# EAGLE design foot-board (EAGLE 9.6.2)
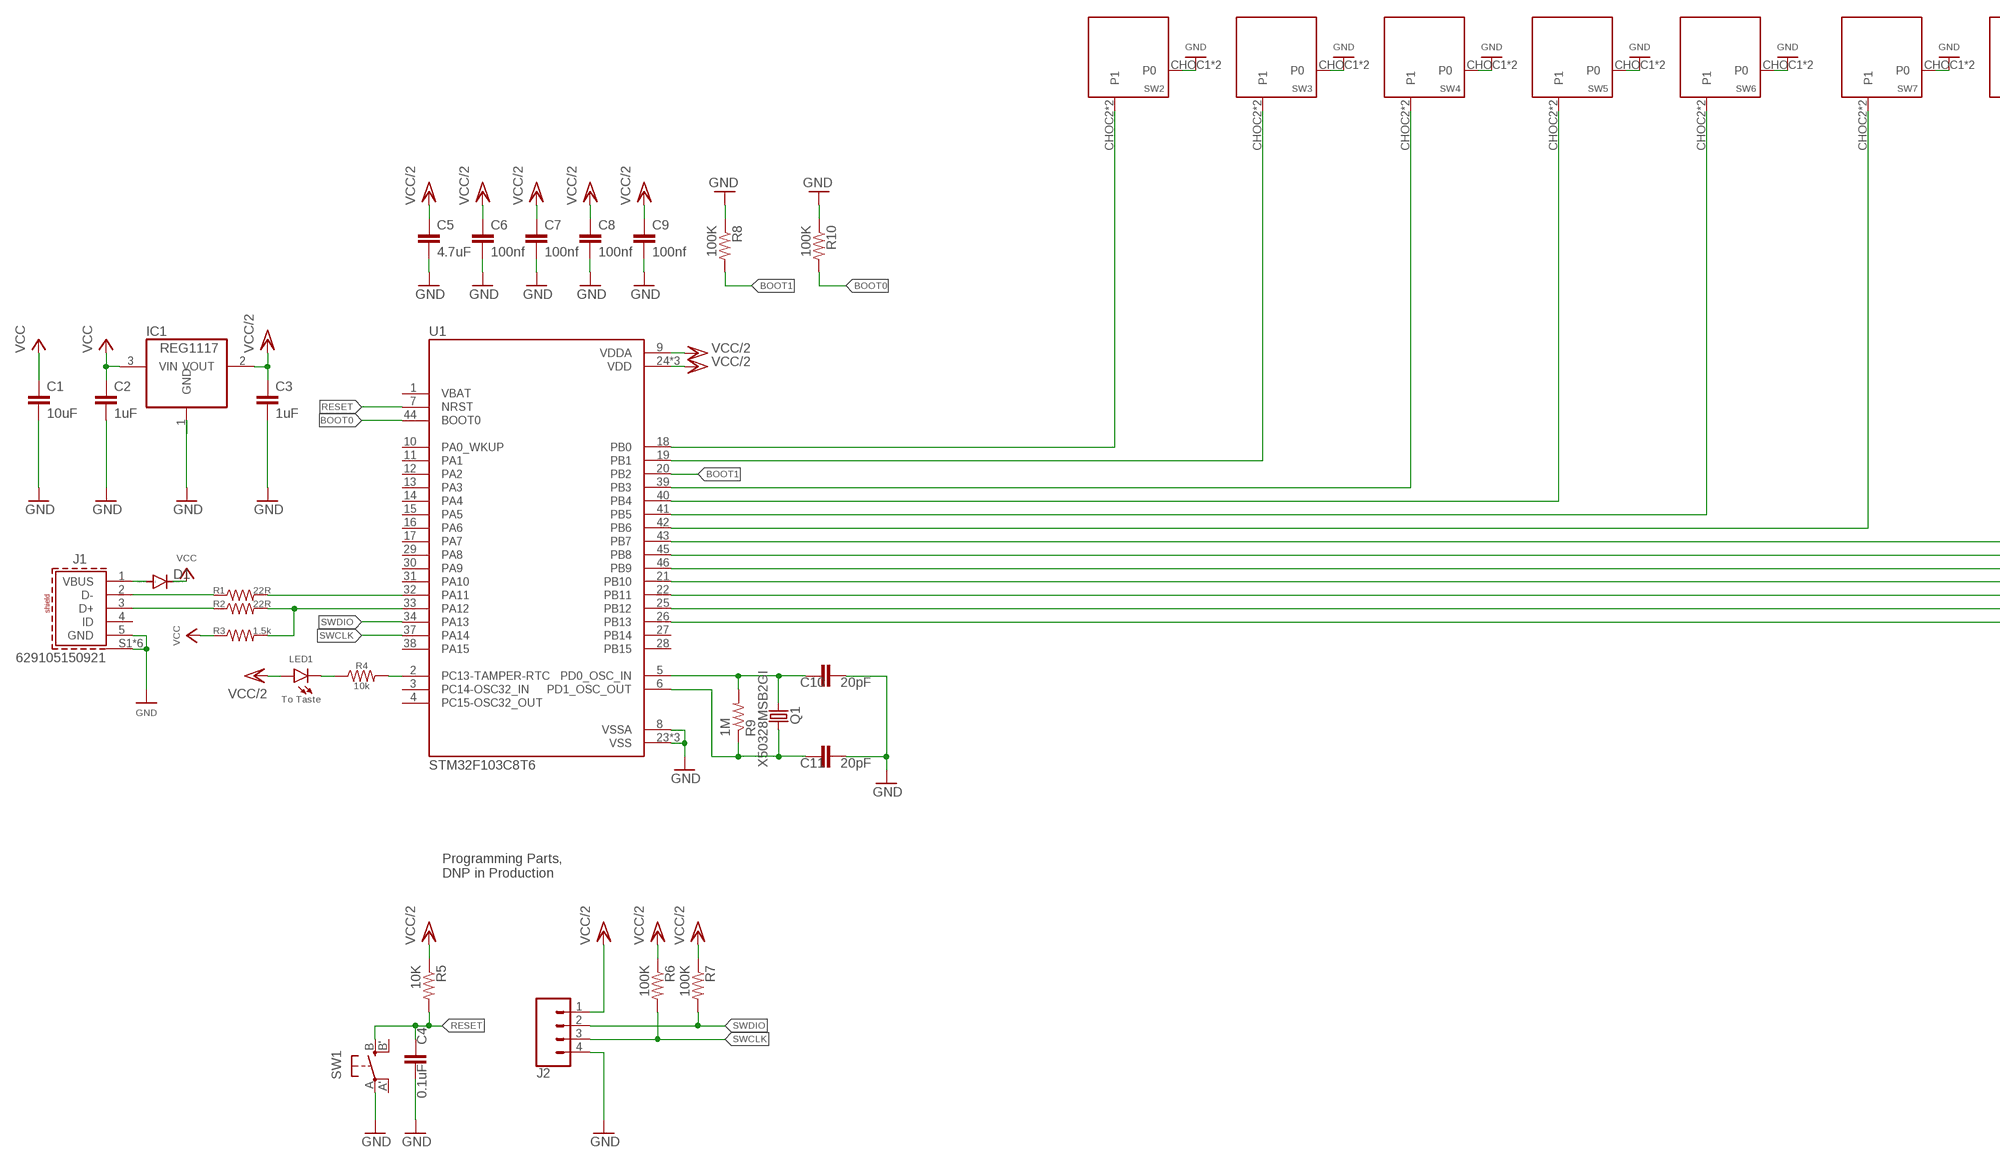
[diagram p0: schematic, sheet 1, part 1 of 2]
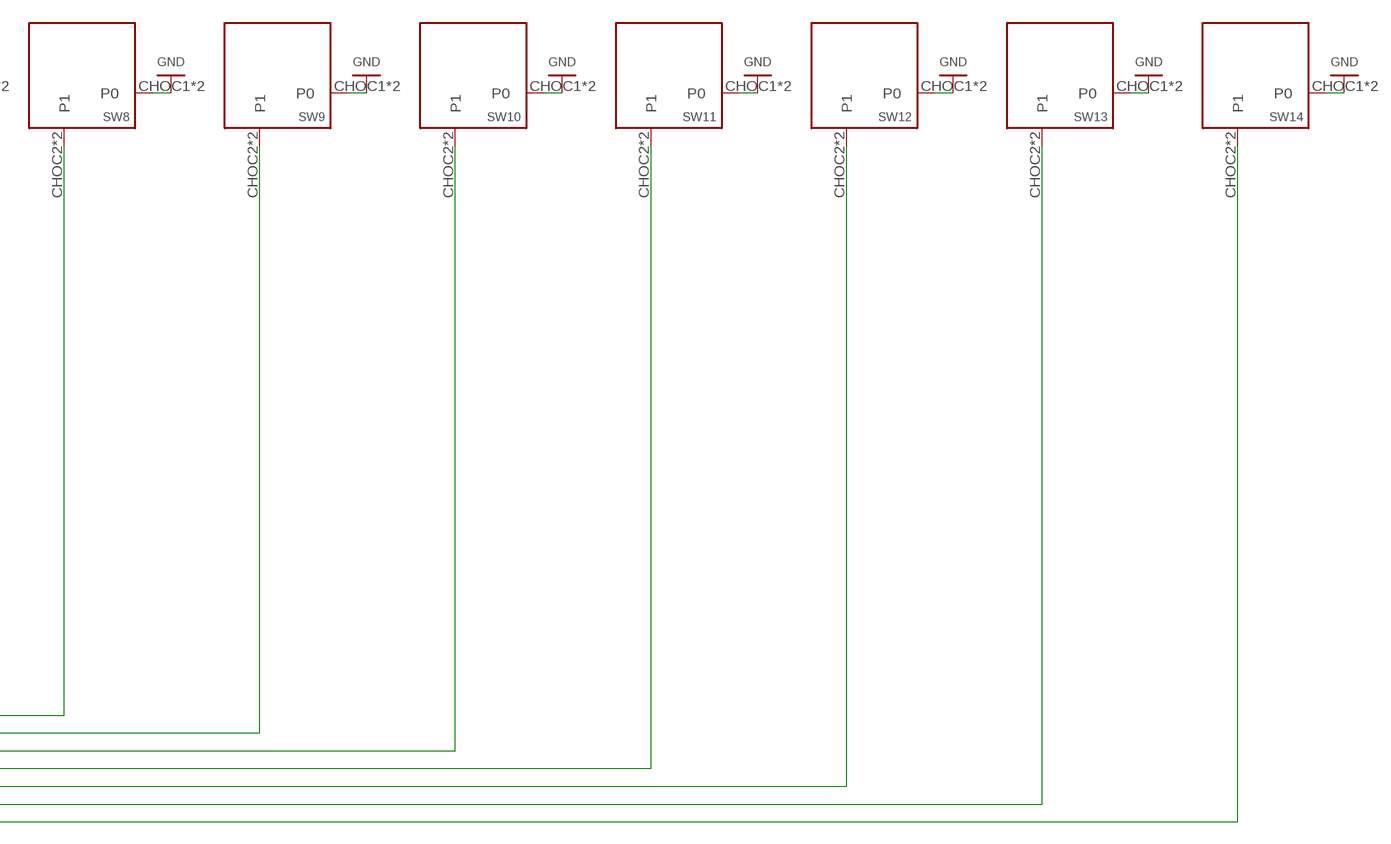
[diagram p1: schematic, sheet 1, part 2 of 2]

## Parts
C1  10uF  C-EUC0805  [C0805]
C2  1uF  C-EUC0402  [C0402]
C3  1uF  C-EUC0402  [C0402]
C4  0.1uF  C-EUC0402  [C0402]
C5  4.7uF  C-EUC0805  [C0805]
C6  100nf  C-EUC0402  [C0402]
C7  100nf  C-EUC0402  [C0402]
C8  100nf  C-EUC0402  [C0402]
C9  100nf  C-EUC0402  [C0402]
C10  20pF  C-EUC0402  [C0402]
C11  20pF  C-EUC0402  [C0402]
D1  DIODE-DO214AC  [DO214AC]
IC1  REG1117  [SOT223]
J1  629105150921  [629105150921]
J2  CONN_04  [1X04]
LED1  To Taste  LEDCHIPLED_0603  [CHIPLED_0603]
Q1  X50328MSB2GI  KX-12B  [6.0X3.5_2]
R1  22R  R-US_R0402  [R0402]
R2  22R  R-US_R0402  [R0402]
R3  1.5k  R-US_R0402  [R0402]
R4  10k  R-US_R0402  [R0402]
R5  10K  R-US_R0402  [R0402]
R6  100K  R-US_R0402  [R0402]
R7  100K  R-US_R0402  [R0402]
R8  100K  R-US_R0402  [R0402]
R9  1M  R-US_R0402  [R0402]
R10  100K  R-US_R0402  [R0402]
SW1  SPST_TACT-EVQQ2  [EVQ-Q2]
SW2  KEYSWITCH-PLAIN-CHOCX-1U  [CHOCX-1U]
SW3  KEYSWITCH-PLAIN-CHOCX-1U  [CHOCX-1U]
SW4  KEYSWITCH-PLAIN-CHOCX-1U  [CHOCX-1U]
SW5  KEYSWITCH-PLAIN-CHOCX-1U  [CHOCX-1U]
SW6  KEYSWITCH-PLAIN-CHOCX-1U  [CHOCX-1U]
SW7  KEYSWITCH-PLAIN-CHOCX-1U  [CHOCX-1U]
SW8  KEYSWITCH-PLAIN-CHOCX-1U  [CHOCX-1U]
SW9  KEYSWITCH-PLAIN-CHOCX-1U  [CHOCX-1U]
SW10  KEYSWITCH-PLAIN-CHOCX-1U  [CHOCX-1U]
SW11  KEYSWITCH-PLAIN-CHOCX-1U  [CHOCX-1U]
SW12  KEYSWITCH-PLAIN-CHOCX-1U  [CHOCX-1U]
SW13  KEYSWITCH-PLAIN-CHOCX-1U  [CHOCX-1U]
SW14  KEYSWITCH-PLAIN-CHOCX-1U  [CHOCX-1U]
U1  STM32F103C8T6  [QFP50P900X900X160-48N]

## Nets
BOOT0: R10.2 U1.44(BOOT0)
BOOT1: R8.2 U1.20(PB2)
GND: C1.2 C2.2 C3.2 C4.2 C5.2 C6.2 C7.2 C8.2 C9.2 C10.2 C11.2 IC1.1(GND) J1.5(GND) J1.S1(SHIELD) J1.S2(SHIELD) J1.S3(SHIELD) J1.S4(SHIELD) J1.S5(SHIELD) J1.S6(SHIELD) J2.4 R8.1 R10.1 SW1.A(P) SW2.CHOC1(P0) SW2.X1(P0) SW3.CHOC1(P0) SW3.X1(P0) SW4.CHOC1(P0) SW4.X1(P0) SW5.CHOC1(P0) SW5.X1(P0) SW6.CHOC1(P0) SW6.X1(P0) SW7.CHOC1(P0) SW7.X1(P0) SW8.CHOC1(P0) SW8.X1(P0) SW9.CHOC1(P0) SW9.X1(P0) SW10.CHOC1(P0) SW10.X1(P0) SW11.CHOC1(P0) SW11.X1(P0) SW12.CHOC1(P0) SW12.X1(P0) SW13.CHOC1(P0) SW13.X1(P0) SW14.CHOC1(P0) SW14.X1(P0) U1.8(VSSA) U1.23(VSS) U1.35(VSS) U1.47(VSS)
N$1: R4.2 U1.2(PC13-TAMPER-RTC)
N$2: LED1.C R4.1
N$3: SW2.CHOC2(P1) SW2.X2(P1) U1.18(PB0)
N$4: R1.2 U1.32(PA11)
N$5: D1.A J1.1(VBUS)
N$6: R2.2 R3.2 U1.33(PA12)
N$10: SW3.CHOC2(P1) SW3.X2(P1) U1.19(PB1)
N$11: SW4.CHOC2(P1) SW4.X2(P1) U1.39(PB3)
N$12: SW5.CHOC2(P1) SW5.X2(P1) U1.40(PB4)
N$13: SW6.CHOC2(P1) SW6.X2(P1) U1.41(PB5)
N$14: SW7.CHOC2(P1) SW7.X2(P1) U1.42(PB6)
N$15: SW8.CHOC2(P1) SW8.X2(P1) U1.43(PB7)
N$16: SW9.CHOC2(P1) SW9.X2(P1) U1.45(PB8)
N$17: SW10.CHOC2(P1) SW10.X2(P1) U1.46(PB9)
N$18: SW11.CHOC2(P1) SW11.X2(P1) U1.21(PB10)
N$19: J1.2(D-) R1.1
N$20: J1.3(D+) R2.1
N$21: SW12.CHOC2(P1) SW12.X2(P1) U1.22(PB11)
N$22: SW13.CHOC2(P1) SW13.X2(P1) U1.25(PB12)
N$23: SW14.CHOC2(P1) SW14.X2(P1) U1.26(PB13)
N$213: C10.1 Q1.2 R9.2 U1.5(PD0_OSC_IN)
N$214: C11.1 Q1.1 R9.1 U1.6(PD1_OSC_OUT)
RESET: C4.1 R5.2 SW1.B(S) U1.7(NRST)
SWCLK: J2.3 R6.2 U1.37(PA14)
SWDIO: J2.2 R7.2 U1.34(PA13)
VCC: C1.1 C2.1 D1.C IC1.3(VIN) R3.1
VCC/2: C3.1 C5.1 C6.1 C7.1 C8.1 C9.1 IC1.2(VOUT) J2.1 LED1.A R5.1 R6.1 R7.1 U1.9(VDDA) U1.24(VDD) U1.36(VDD) U1.48(VDD)
Unconnected: J1.4(ID) SW1.A'(P1) SW1.B'(S1) U1.1(VBAT) U1.3(PC14-OSC32_IN) U1.4(PC15-OSC32_OUT) U1.10(PA0_WKUP) U1.11(PA1) U1.12(PA2) U1.13(PA3) U1.14(PA4) U1.15(PA5) U1.16(PA6) U1.17(PA7) U1.27(PB14) U1.28(PB15) U1.29(PA8) U1.30(PA9) U1.31(PA10) U1.38(PA15)

## Notes on the sheet
- Programming Parts, 
  DNP in Production

## Library data of the parts
C1-C11 = rcl:C-EU: CAPACITOR, European symbol; SPICEPREFIX: C
D1 = diode:DIODE-: DIODE
IC1 = burr-brown:REG1117: 800mA and 1A Low Dropout (LDO) Positive Regulator 1.8V, 2.5V, 2.85V, 3.3V, 5V, and Adj; MPN: REG1117; OC_FARNELL: 1097566; OC_NEWARK: 14P6981
J1 = Wurth_Connectors_WR-USB:629105150921: WR-COM Micro USB 2.0 Type AB Horizontal Kind Properties Durability:10 000 Mating cycles Connector Type:Micro USB Gender:Receptacle Type:Horizontal General Information Operating Temperature:-40up to +85 °C Electrical Properties Working Voltage:30V (AC) Withstanding Voltage:100V (AC) Contact Resistance:30 mΩ Material Properties Insulator Material:LCP Insulator Flammability Rating:UL94 V-0 Color:Black Contact Material:Copper Alloy Contact Plating: Gold Contact Type:Stamped Shielding Material:Stainless Steel Shielding Plating:Matte Tin <https://www.we-online.com/catalog/media/o33046v209%20Family_WR-COM_Micro_USB_629105150921.jpg> Details see: https://www.we-online.com/catalog/en/COM_MICRO_2_0_TYPE_AB_HORIZONTAL/ Updated by Ella Wu 2020-05-27 2020 (C) Würth Elektronik; APPLICATION: Micro USB 2.0; DATASHEET-URL: https://www.we-online.com/catalog/datasheet/629105150921.pdf; GERDER: Receptacle; INTERFACE-TYPE: Type AB; IR1: 1.8A; MOUNT: SMT; PACKAGING: Tape and Reel; PART-NUMBER: 629105150921; PINS: 5; TYPE: Horizontal; WORKING-VOLTAGE: 30V(AC)
J2 = SparkFun-Connectors:CONN_04: Multi connection point. Often used as Generic Header-pin footprint for 0.1 inch spaced/style header connections On any of the 0.1 inch spaced packages, you can populate with these: Break Away Headers - Straight <https://www.sparkfun.com/products/116> (PRT-00116) Break Away Male Headers - Right Angle <https://www.sparkfun.com/products/553> (PRT-00553) Female Headers <https://www.sparkfun.com/products/115> (PRT-00115) Break Away Headers - Machine Pin <https://www.sparkfun.com/products/117> (PRT-00117) Break Away Female Headers - Swiss Machine Pin <https://www.sparkfun.com/products/743> (PRT-00743) For SCREWTERMINALS and SPRING TERMINALS visit here: Screw Terimnals on SparkFun.com <https://www.sparkfun.com/search/results?term=Screw+Terminals> (5mm/3.5mm/2.54mm spacing) This device is also useful as a general connection point to wire up your design to another part of your project. Our various solder wires solder well into these plated through hole pads. Hook-Up Wire - Assortment (Stranded, 22 AWG) <https://www.sparkfun.com/products/11375> (PRT-11375) Hook-Up Wire - Assortment (Solid Core, 22 AWG) <https://www.sparkfun.com/products/11367> (PRT-11367) View the entire wire category on our website here <https://www.sparkfun.com/categories/141> Special notes: Molex polarized connector foot print use with SKU : PRT-08231 with associated crimp pins and housings. 1MM SMD Version SKU: PRT-10208; PROD_ID: CONN-09696
LED1 = led:LED: LED OSRAM: - CHIPLED LG R971, LG N971, LY N971, LG Q971, LY Q971, LO R971, LY R971 LH N974, LH R974 LS Q976, LO Q976, LY Q976 LO Q996 - Hyper CHIPLED LW Q18S LB Q993, LB Q99A, LB R99A - SideLED LS A670, LO A670, LY A670, LG A670, LP A670 LB A673, LV A673, LT A673, LW A673 LH A674 LY A675 LS A676, LA A676, LO A676, LY A676, LW A676 LS A679, LY A679, LG A679 - Hyper Micro SIDELED® LS Y876, LA Y876, LO Y876, LY Y876 LT Y87S - SmartLED LW L88C, LW L88S LB L89C, LB L89S, LG L890 LS L89K, LO L89K, LY L89K LS L896, LA L896, LO L896, LY L896 - TOPLED LS T670, LO T670, LY T670, LG T670, LP T670 LSG T670, LSP T670, LSY T670, LOP T670, LYG T670 LG T671, LOG T671, LSG T671 LB T673, LV T673, LT T673, LW T673 LH T674 LS T676, LA T676, LO T676, LY T676, LB T676, LH T676, LSB T676, LW T676 LB T67C, LV T67C, LT T67C, LS T67K, LO T67K, LY T67K, LW E67C LS E67B, LA E67B, LO E67B, LY E67B, LB E67C, LV E67C, LT E67C LW T67C LS T679, LY T679, LG T679 LS T770, LO T770, LY T770, LG T770, LP T770 LB T773, LV T773, LT T773, LW T773 LH T774 LS E675, LA E675, LY E675, LS T675 LS T776, LA T776, LO T776, LY T776, LB T776 LHGB T686 LT T68C, LB T68C - Hyper Mini TOPLED® LB M676 - Mini TOPLED Santana® LG M470 LS M47K, LO M47K, LY M47K Source: http://www.osram.convergy.de LUXEON: - LUMILED® LXK2-PW12-R00, LXK2-PW12-S00, LXK2-PW14-U00, LXK2-PW14-V00 LXK2-PM12-R00, LXK2-PM12-S00, LXK2-PM14-U00 LXK2-PE12-Q00, LXK2-PE12-R00, LXK2-PE12-S00, LXK2-PE14-T00, LXK2-PE14-U00 LXK2-PB12-K00, LXK2-PB12-L00, LXK2-PB12-M00, LXK2-PB14-N00, LXK2-PB14-P00, LXK2-PB14-Q00 LXK2-PR12-L00, LXK2-PR12-M00, LXK2-PR14-Q00, LXK2-PR14-R00 LXK2-PD12-Q00, LXK2-PD12-R00, LXK2-PD12-S00 LXK2-PH12-R00, LXK2-PH12-S00 LXK2-PL12-P00, LXK2-PL12-Q00, LXK2-PL12-R00 Source: www.luxeon.com KINGBRIGHT: KA-3528ASYC Source: www.kingbright.com
Q1 = crystal-geyer_V1_0:KX: Quartz Crystals (MHz) SMD: KX - Serie Model Size l/w/h [mm] Frequency Range Frequency Stability Temp. Range [°C] Load Capacitance AECQ 200 availabel Datasheet KX-4 KX-5 KX-6 KX-7 KX-9A KX-9B KX-12A KX-12B KX-13 KX-20 KX-K KX-KS 1.6/1.2/0.3 2.0/1.6/0.45 2.5/2.0/0.55 3.2/2.5/0.8 5.0/3.2/1.0 5.0/3.2/1.1 6.0/3.5/1.1 6.0/3.5/1.0 7.0/5.0 /1.3 11.6/5.5/1.6 12.3/4.5/4.2 12.3/4.5/3.2 24.0 ~ 80.0 MHz 16.0 ~ 80.0 MHz 12.0 ~ 80.0 MHz 8.0 ~ 60.0 MHz 7,68 ~ 300,0 MHz 8,0 ~ 50,0 MHz 8,0 ~ 150,0 MHz 8,0 ~ 50,0 MHz 6,0 ~ 160,0 MHz 3,579 ~ 25,0 MHz 3,579 ~ 70,0 MHz 3,579 ~ 70,0 MHz ±10 … ±50ppm ±10 … ±50ppm ±10 … ±50ppm ±10 … ±50ppm ±10 … ±50ppm ±10 … ±50ppm ±10 … ±50ppm ±10 … ±50ppm ±10 … ±50ppm ±50ppm ±10 … ±50ppm ±10 … ±50ppm (*) -40°C …+85°C (*) -40°C …+125°C (*) -40°C …+125°C (*) -40°C …+125°C (*) -40°C …+105°C (*) -40°C …+105°C (*) -40°C …+125°C (*) -40°C …+105°C (*) -40°C …+105°C (*) -40°C …+105°C (*) -40°C …+85°C (*) -40°C …+85°C 8, 8…16 8, 8…16 10, 8…16 12, 7…20 16, 10…20 16, 10…20 16, 10…20 16, 12…20 16, 12…20 16, 12…20 16, 12…30 16, 12…30 - yes yes yes - - - - - - - - KX-4.pdf <http://www.geyer-electronic.de/uploads/tx_userartikelfrequenz/GEYER-KX-4.pdf> KX-5.pdf <http://www.geyer-electronic.de/uploads/tx_userartikelfrequenz/GEYER-KX-5.pdf> KX-6.pdf <http://www.geyer-electronic.de/uploads/tx_userartikelfrequenz/GEYER-KX-6.pdf> KX-7.pdf <http://www.geyer-electronic.de/uploads/tx_userartikelfrequenz/GEYER-KX-7.pdf> KX-9A.pdf <http://www.geyer-electronic.de/uploads/tx_userartikelfrequenz/GEYER-KX-9A.pdf> KX-9B.pdf <http://www.geyer-electronic.de/uploads/tx_userartikelfrequenz/GEYER-KX-9B.pdf> KX-12A.pdf <http://www.geyer-electronic.de/uploads/tx_userartikelfrequenz/GEYER-KX-12A.pdf> KX-12B.pdf <http://www.geyer-electronic.de/uploads/tx_userartikelfrequenz/GEYER-KX-12B.pdf> KX-13.pdf <http://www.geyer-electronic.de/uploads/tx_userartikelfrequenz/GEYER-KX-13.pdf> KX-20.pdf <http://www.geyer-electronic.de/uploads/tx_userartikelfrequenz/GEYER-KX-20.pdf> KX-K.pdf <http://www.geyer-electronic.de/uploads/tx_userartikelfrequenz/GEYER-KX-K.pdf> KX-KS.pdf <http://www.geyer-electronic.de/uploads/tx_userartikelfrequenz/GEYER-KX-KS.pdf> <http://www.geyer-electronic.de/fileadmin/template/img/logo-geyer-electronic.png> Details see: http://www.geyer-electronic.de/Frequenz-Produkte.9.0.html Created 2016-06-07, Hans Locher 2016 (C) Geyer Quartz Technology KX4,KX5,KX6,KX7,KX9A,KX9B,KX12A,KX12B,KX13,KX20,KXK,KXKS;1612;2016;2520;3225;5032;6035;7050;11655;12345;1,6x1,2;2,0x1,6;2,5x2,0;3,2x2,5;5,0x3,2;6,0x3,5;7,0x5,0;11,6x5,5;12,3x4,5;12,3x4,5;1.6x1.2;2.0x1.6;2.5x2.0;3.2x2.5;5.0x3.2;6.0x3.5;7.0x5.0;11.6x5.5;12.3x4.5;12.3x4.5;
R1-R10 = rcl:R-US_: RESISTOR, American symbol; SPICEPREFIX: R
SW1 = adafruit:SPST_TACT: SMT 6mm switch, EVQQ2 series http://www.ladyada.net/library/eagle
SW2-SW14 = Keyswitch:KEYSWITCH-PLAIN
U1 = STM32F103C8T6:STM32F103C8T6: Mainstream Performance line, ARM Cortex-M3 MCU with 64 Kbytes Flash, 72 MHz CPU, motor control, USB and CAN; AVAILABILITY: Unavailable; DESCRIPTION: ARM® Cortex®-M3 STM32F1 Microcontroller IC 32-Bit 72MHz 64KB (64K x 8) FLASH 48-LQFP (7x7); MF: STMicroelectronics; MP: STM32F103C8T6; PACKAGE: LQFP-48 STMicroelectronics; PRICE: None

## Board
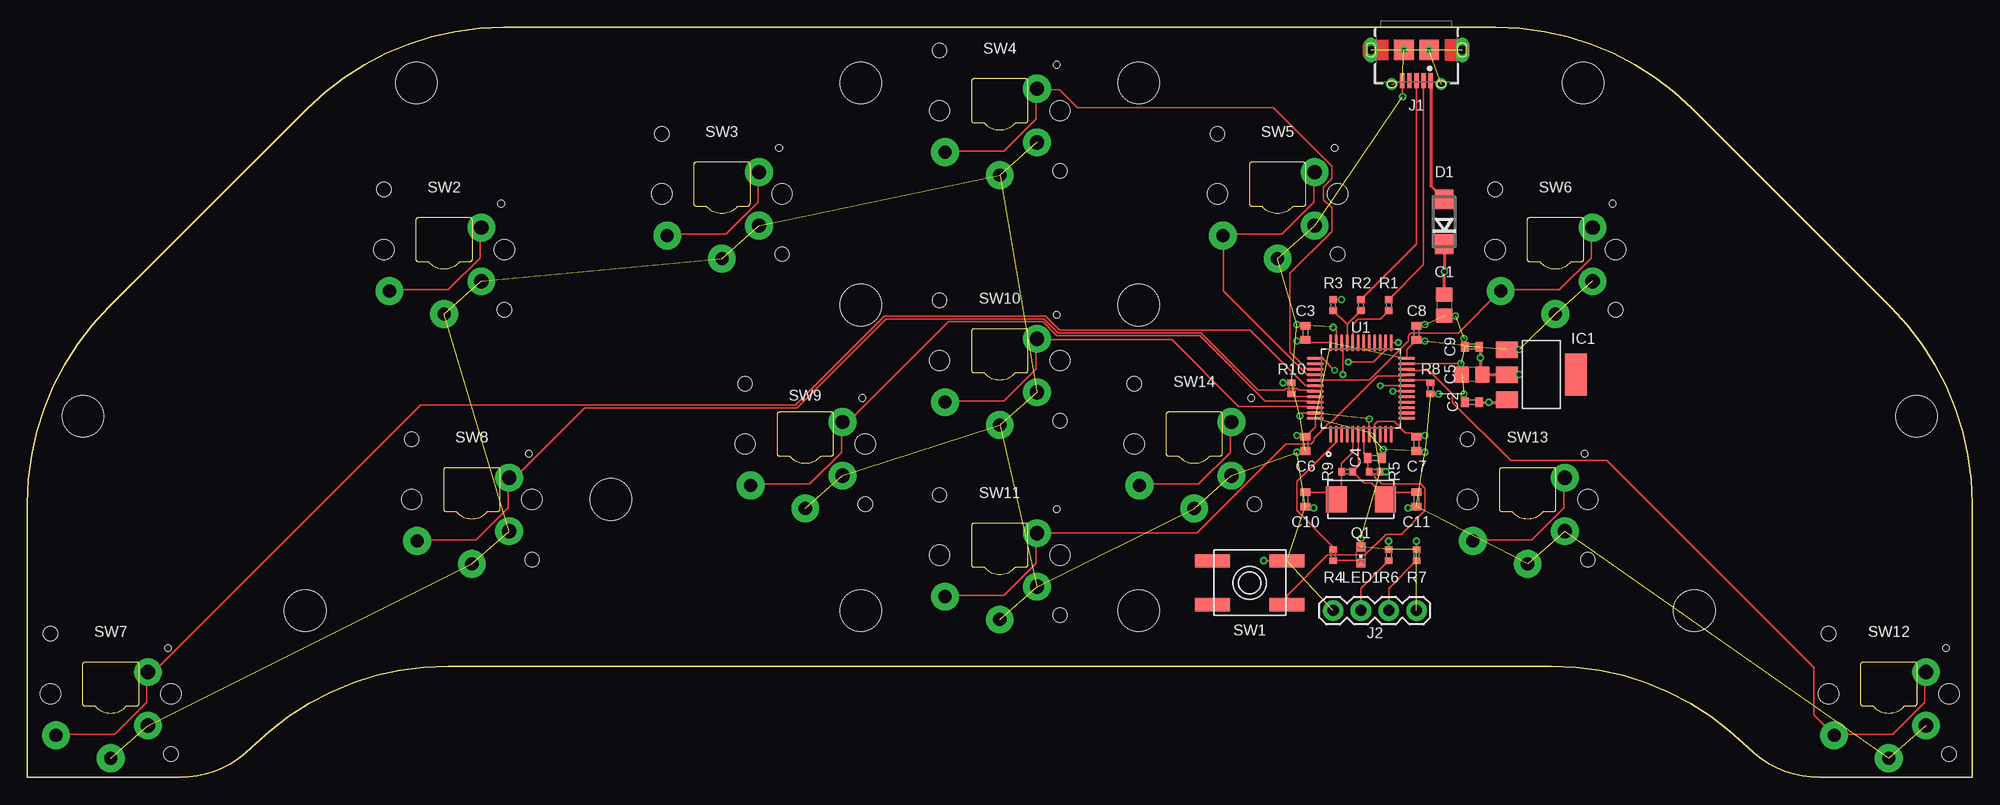
[diagram p2: board, top side]
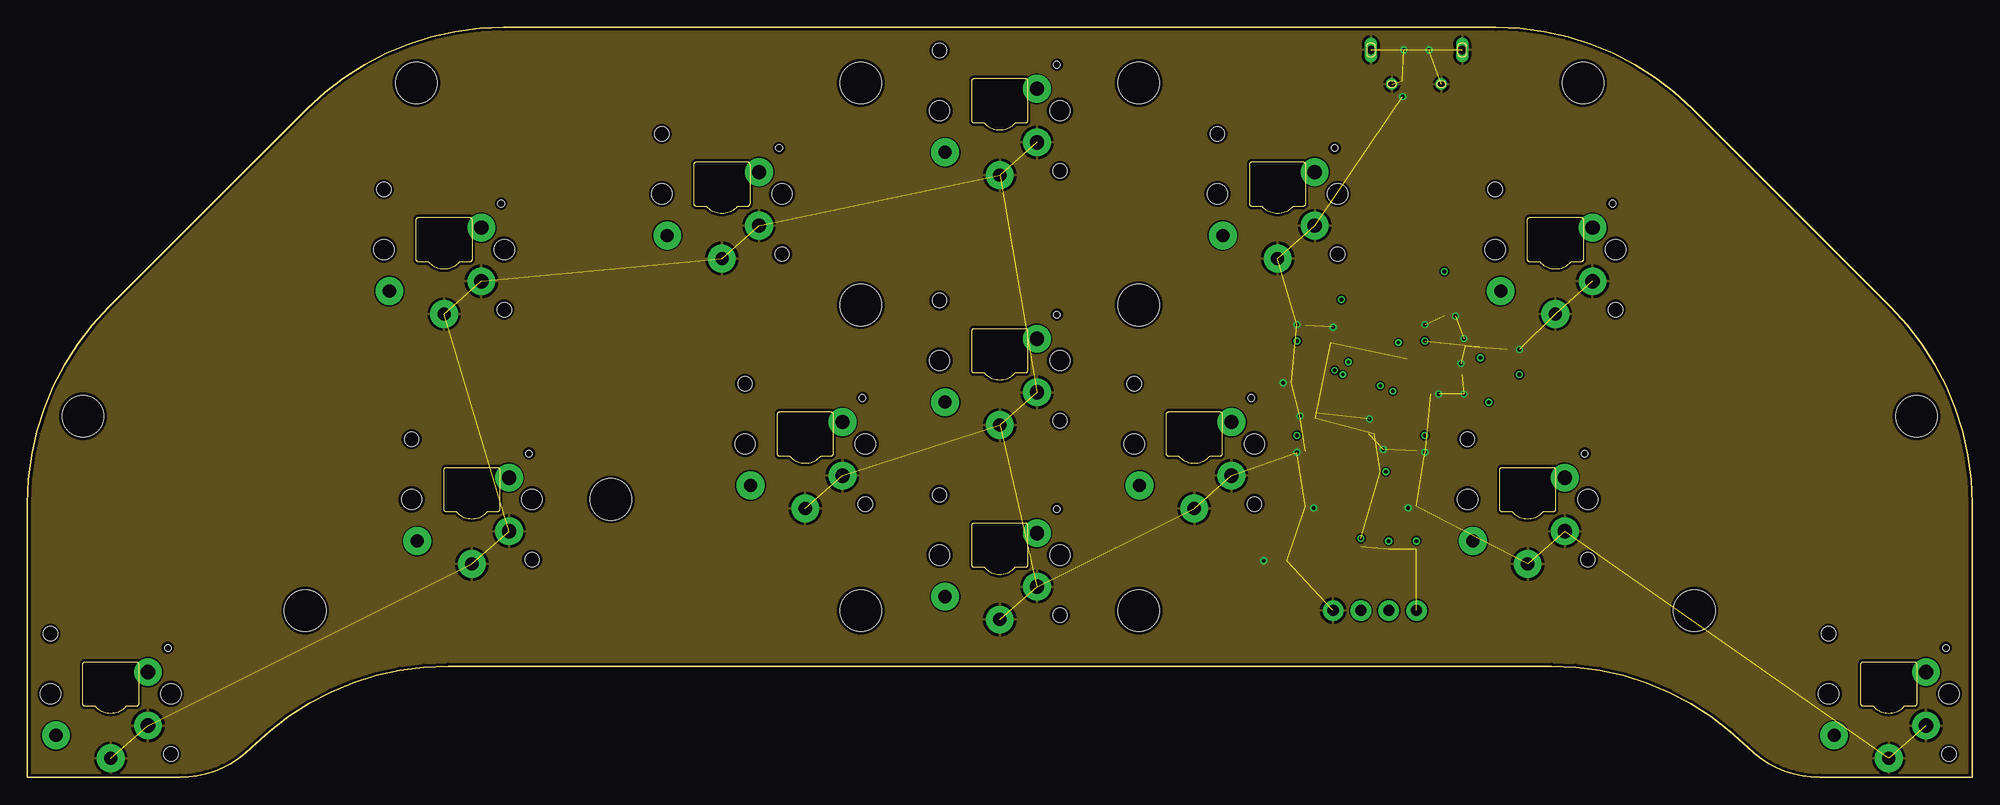
[diagram p3: board, inner layer Route2]
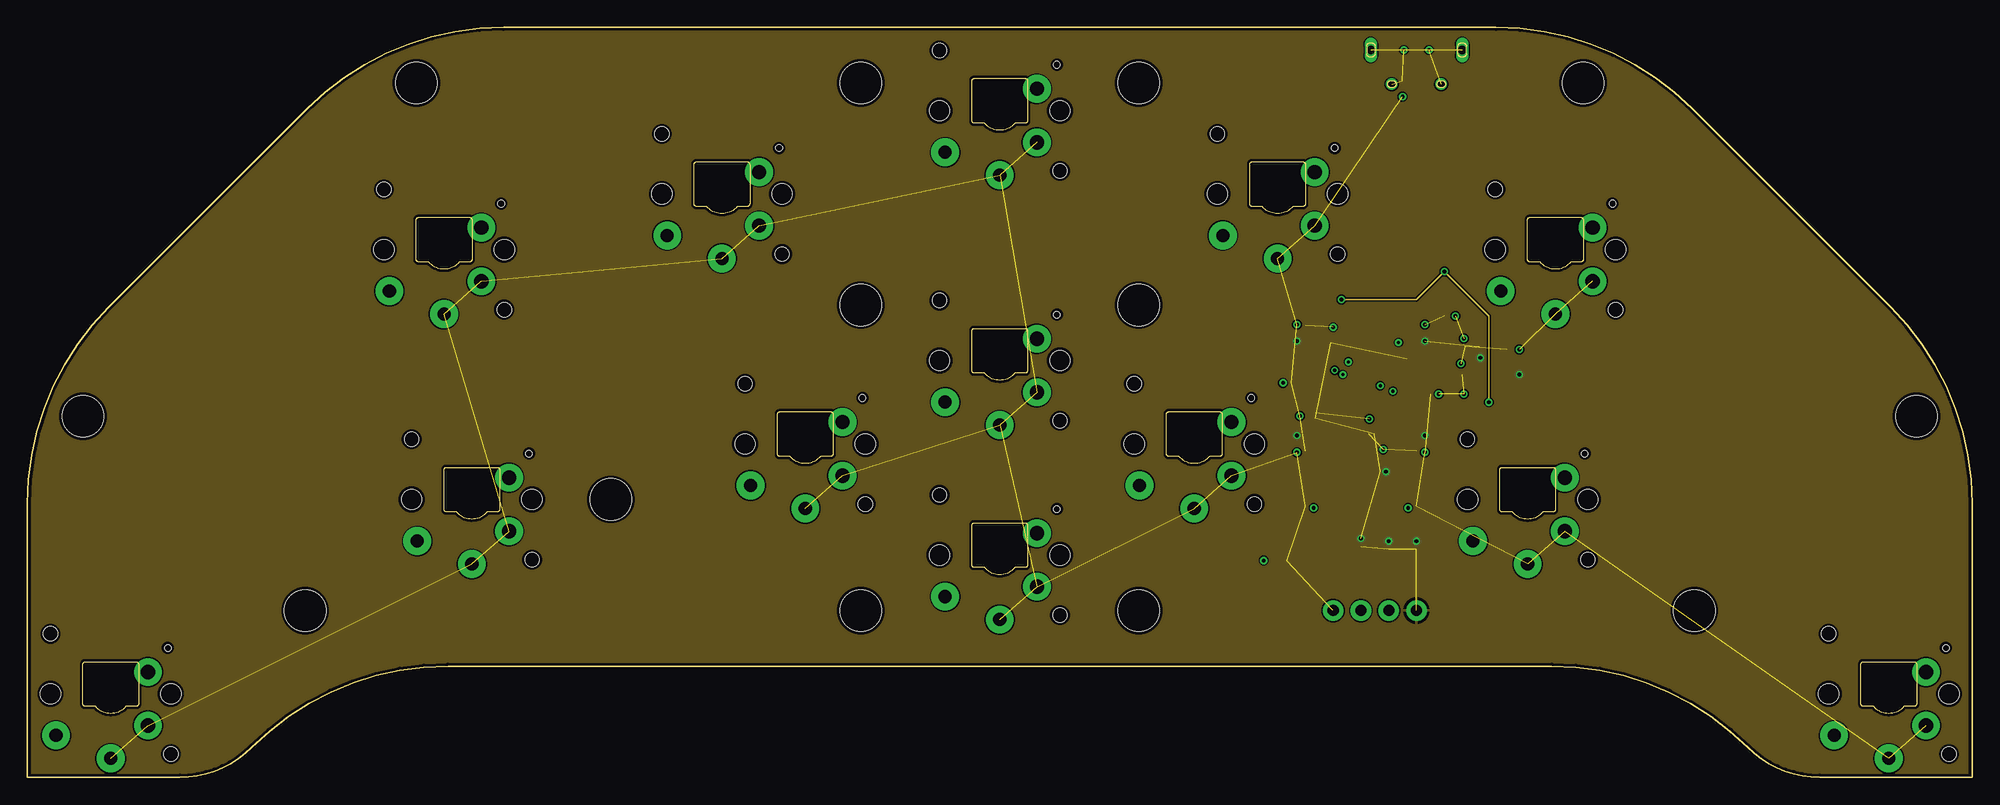
[diagram p4: board, inner layer Route15]
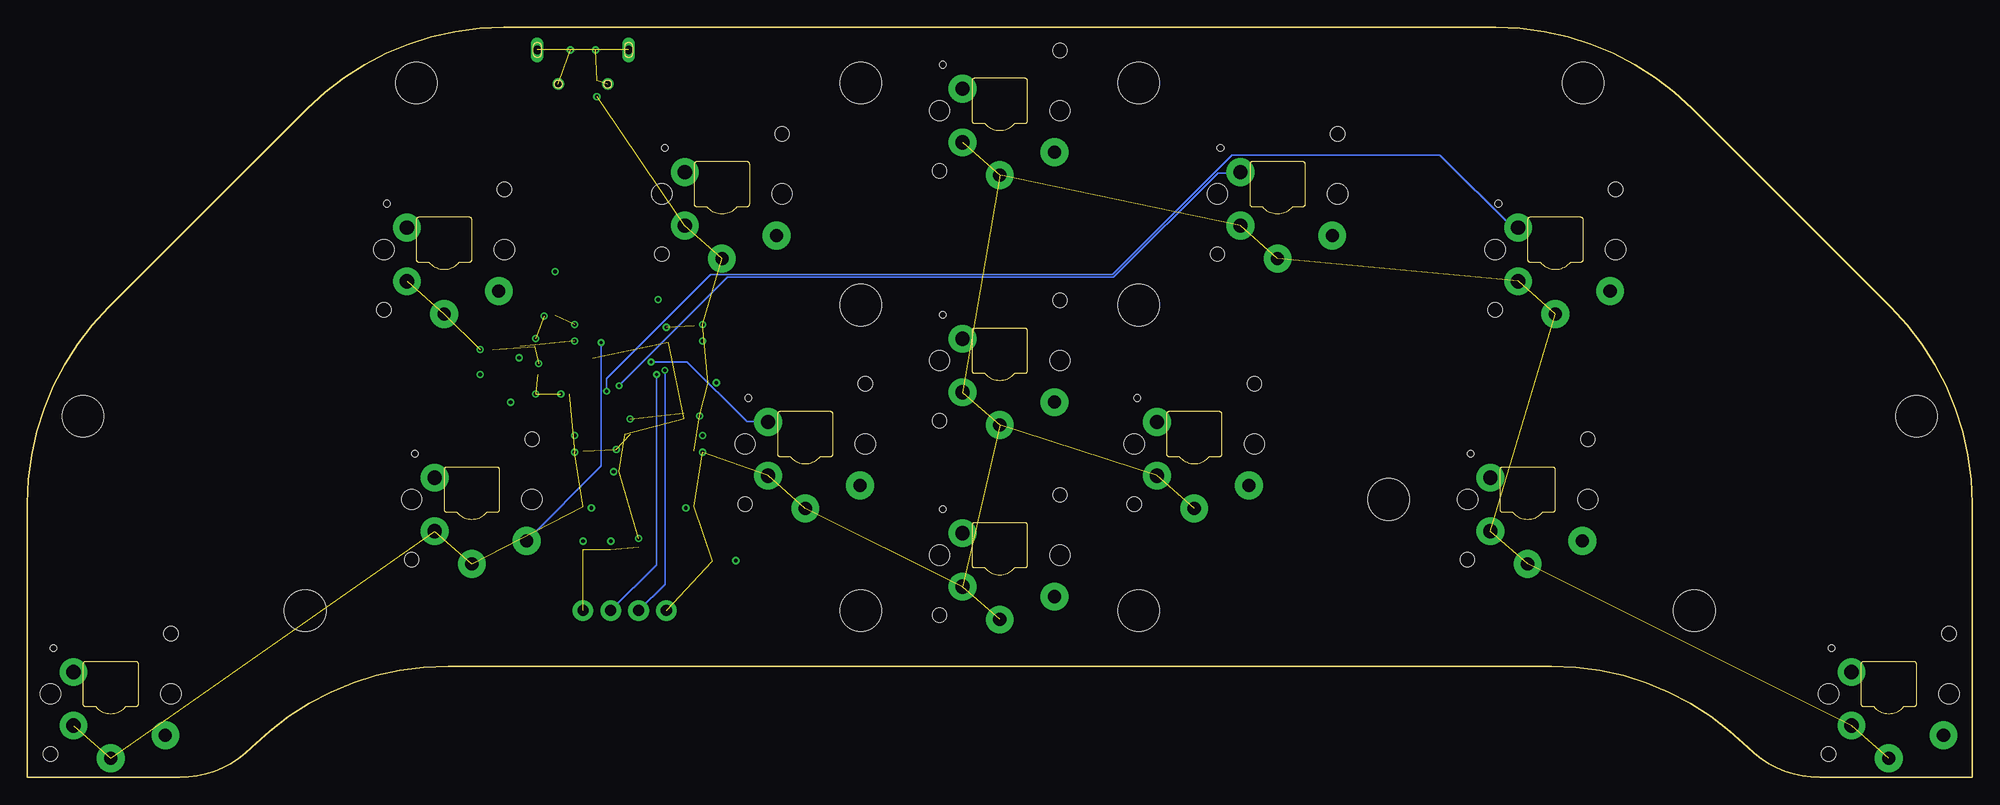
[diagram p5: board, bottom side, seen from below]

Size 177.8 x 68.58 mm. Coordinates in mm from the lower left corner, seen from the top.
Outline: 0,0 13.93,0 arc45 20.5,2.72 arc-45 38.46,10.16 139.34,10.16 arc-45 157.3,2.72 arc45 163.87,0 177.8,0 177.8,25.04 arc45 170.36,43 152.22,61.14 arc45 134.26,68.58 43.54,68.58 arc45 25.58,61.14 7.44,43 arc45 0,25.04 0,0
Copper layers (1*2*15*16): Top 0.035mm / dielectric 0.23mm / Route2 0.035mm / dielectric 0.93mm / Route15 0.035mm / dielectric 0.23mm / Bottom 0.035mm
Design rules "MF_Standard_4_Layer": minimum track width 5mil, minimum drill 12mil, track to track 5mil, track to pad 5mil, pad to pad 5mil, via to via 5mil, smd to smd 0mil, copper to edge 10mil, drill to drill 10mil, minimum pad ring 6mil, minimum via ring 6mil, stop-mask expansion 2mil, vias tented up to drill 25mil, thermal gap 10mil
Holes 3.81 mm at 101.6,15.24 76.2,43.18 101.6,43.18 152.4,15.24 53.34,25.4 35.56,63.5 5.08,33.02 25.4,15.24 76.2,63.5 76.2,15.24 101.6,63.5 172.72,33.02 142.24,63.5

### Footprints (pad centres in the part's own frame; a part is rotated, then mirrored left to right if it is on the bottom)
C0805 = smd 1.3 x 1.5: 1 -0.95,0; 2 0.95,0
C0402 = smd 0.7 x 0.9: 1 -0.65,0; 2 0.65,0
DO214AC = smd 1.8 x 1.7: A 2.05,0; C -2.05,0
SOT223 = smd 1.499 x 2.007: 1 -2.261,-3.15; 2 0.025,-3.15; 3 2.311,-3.15 | smd 3.81 x 2.007: 4 0,3.15
629105150921 = smd 0.4 x 1.35: 1 -1.3,2.335; 2 -0.65,2.335; 3 0,2.335; 4 0.65,2.335; 5 1.3,2.335 | drill 0.65 pad 1.05: S1 -2.26,2.65; S2 2.26,2.65 | drill 0.75 pad 0.95 long: S3 -4.175,-0.47; S6 4.175,-0.47 | smd 1.8 x 1.9: S4 -1.15,-0.47; S5 1.15,-0.47
1X04 = drill 1.016 pad 1.88: 1 0,0; 2 2.54,0; 3 5.08,0; 4 7.62,0
CHIPLED_0603 = smd 0.8 x 0.8: A 0,-0.75; C 0,0.75
6.0X3.5_2 = smd 1.9 x 2.4: 1 -2.25,0; 2 2.25,0
R0402 = smd 0.6 x 0.7: 1 -0.5,0; 2 0.5,0
EVQ-Q2 = smd 3.2 x 1.2: A -3.4,-2; A' 3.4,-2; B -3.4,2; B' 3.4,2
CHOCX-1U = drill 1.2 pad 2.54: CHOC1 0,5.9; CHOC2 5,3.8 | drill 1.3 pad 2.54: X1 -3.4,2.9; X2 -3.4,-2 | hole 0.6: -5.22,-4.2 | hole 1.3: -5.5,5.5; 5.5,-5.5 | hole 1.85: -5.5,0; 5.5,0
QFP50P900X900X160-48N = smd 1.56 x 0.28: 1 -4.18,2.75; 2 -4.18,2.25; 3 -4.18,1.75; 4 -4.18,1.25; 5 -4.18,0.75; 6 -4.18,0.25; 7 -4.18,-0.25; 8 -4.18,-0.75; 9 -4.18,-1.25; 10 -4.18,-1.75; 11 -4.18,-2.25; 12 -4.18,-2.75; 25 4.18,-2.75; 26 4.18,-2.25; 27 4.18,-1.75; 28 4.18,-1.25; 29 4.18,-0.75; 30 4.18,-0.25; 31 4.18,0.25; 32 4.18,0.75; 33 4.18,1.25; 34 4.18,1.75; 35 4.18,2.25; 36 4.18,2.75 | smd 0.28 x 1.56: 13 -2.75,-4.18; 14 -2.25,-4.18; 15 -1.75,-4.18; 16 -1.25,-4.18; 17 -0.75,-4.18; 18 -0.25,-4.18; 19 0.25,-4.18; 20 0.75,-4.18; 21 1.25,-4.18; 22 1.75,-4.18; 23 2.25,-4.18; 24 2.75,-4.18; 37 2.75,4.18; 38 2.25,4.18; 39 1.75,4.18; 40 1.25,4.18; 41 0.75,4.18; 42 0.25,4.18; 43 -0.25,4.18; 44 -0.75,4.18; 45 -1.25,4.18; 46 -1.75,4.18; 47 -2.25,4.18; 48 -2.75,4.18

### Placement (x,y rotation side)
C1  129.54,43.18 270 top
C2  132.08,34.29 180 top
C3  116.84,40.64 90 top
C4  123.19,29.21 0 top
C5  132.08,36.83 180 top
C6  116.84,30.48 270 top
C7  127,30.48 270 top
C8  127,40.64 90 top
C9  132.08,39.37 180 top
C10  116.84,25.4 270 top
C11  127,25.4 270 top
D1  129.54,50.8 90 top
IC1  138.43,36.83 270 top
J1  127,66.04 180 top
J2  127,15.24 180 top
LED1  121.92,20.32 180 top
Q1  121.92,25.4 180 top
R1  124.46,43.18 270 top
R2  121.92,43.18 270 top
R3  119.38,43.18 270 top
R4  119.38,20.32 90 top
R5  123.19,27.94 180 top
R6  124.46,20.32 270 top
R7  127,20.32 270 top
R8  128.27,35.56 90 top
R9  120.65,27.94 180 top
R10  115.57,35.56 270 top
SW1  111.76,17.78 180 top
SW2  38.1,48.26 180 top
SW3  63.5,53.34 180 top
SW4  88.9,60.96 180 top
SW5  114.3,53.34 180 top
SW6  139.7,48.26 180 top
SW7  7.62,7.62 180 top
SW8  40.64,25.4 180 top
SW9  71.12,30.48 180 top
SW10  88.9,38.1 180 top
SW11  88.9,20.32 180 top
SW12  170.18,7.62 180 top
SW13  137.16,25.4 180 top
SW14  106.68,30.48 180 top
U1  121.92,35.56 90 top

### Tracks (layer width: path | path; a pad name or v marks a point on that pad's centre or on a via)
BOOT0
  Top 0.152: U1.44 115.82,34.81 R10.2
BOOT1
  Top 0.152: U1.20 128.02,36.31 R8.2
GND  (via drill 0.35)  (51 unrouted)
  Top 0.127: v131.06,37.85 126.11,37.85 U1.23
  Top 0.152: C9.2 131.32,39.48 | C5.2 131.06,36.9 | C1.2 130.49,42.23 v130.56,42.16 | v127.76,41.4 127.65,41.29 C8.2 | C2.2 131.32,34.4 | v127.76,29.72 127.11,29.72 C7.2 | C6.2 116.19,29.83 v116.08,29.72 | U1.8 122.67,32.75 v122.68,32.77 | C4.2 123.84,29.86 v123.95,29.97 | C11.2 126.89,24.64 v126.24,24.64 | C10.2 117.49,24.75 v117.6,24.64 | U1.35 119.67,40.86 v119.38,41.15 | C3.2 116.19,41.29 v116.08,41.4 | U1.47 116.62,33.31 v116.33,33.02 | SW1.A 113.06,19.78 v113.03,19.81 | J1.5 125.7,62.26 v125.73,62.23 | R8.1 v129.02,35.06 v129.03,35.05 | R10.1 v114.82,36.06 v114.81,36.07
  Top 0.254: C5.2 131.06,36.9 v131.06,37.85 | IC1.1 135.31,39.12 v136.4,39.12 | C9.2 131.32,39.48 v131.32,40.13 | C2.2 131.32,34.4 v131.32,35.05
  other vias: 125.85,66.51 128.15,66.51
  pour Route2: 0,0 177.8,0 177.8,68.58 0,68.58
N$1
  Top 0.127: R4.2 119.38,21.08 116.08,24.38 116.08,27.05 119.63,30.61 119.63,31.37 U1.2
N$2
  Top 0.152: R4.1 121.67,19.82 LED1.C
N$3  (via drill 0.3)
  Top 0.127: v124.84,35.31 125.98,35.31 U1.18 | SW2.CHOC2 33.15,44.58 38.48,44.58 41.4,47.5 41.4,50.16 SW2.X2
  Bottom 0.127: v124.84,35.31 124.84,36.45 115.32,45.97 78.61,45.97 67.69,56.9 48.64,56.9 42.04,50.29 41.53,50.29 SW2.X2
N$4
  Top 0.152: U1.32 121.17,41.41 121.67,41.91 123.69,41.91 R1.2
N$5
  Top 0.254: J1.1 128.3,54.09 D1.A
N$6
  Top 0.152: U1.33 120.67,41.43 | 120.67,41.43 R2.2 | R3.2 120.63,41.43 120.67,41.43
N$10  (via drill 0.3)
  Top 0.127: v123.7,35.81 125.98,35.81 U1.19 | SW3.CHOC2 58.55,49.66 63.88,49.66 66.8,52.58 66.8,55.24 SW3.X2
  Bottom 0.127: v123.7,35.81 113.79,45.72 78.49,45.72 68.96,55.24 66.93,55.24 SW3.X2
N$11
  Top 0.127: U1.39 117.73,37.34 116.97,37.34 115.44,38.86 115.44,46.1 119.25,49.91 119.25,52.07 118.49,52.83 118.49,53.98 119.25,54.74 119.25,55.88 113.92,61.21 96.01,61.21 94.36,62.87 92.33,62.87 SW4.X2 92.2,62.87 92.2,60.2 89.28,57.28 83.95,57.28 SW4.CHOC2
N$12
  Top 0.127: U1.40 117.73,36.83 116.97,36.83 109.35,44.45 109.35,49.53 SW5.CHOC2 109.35,49.66 114.68,49.66 117.6,52.58 117.6,55.24 SW5.X2
N$13
  Top 0.127: U1.41 117.86,36.32 122.68,36.32 126.24,39.88 126.24,40.39 126.49,40.64 130.81,40.64 134.62,44.45 SW6.CHOC2 134.75,44.58 140.08,44.58 143,47.5 143,50.16 SW6.X2
N$14
  Top 0.127: U1.42 117.73,35.81 116.84,35.81 111.76,40.89 94.36,40.89 93.09,42.16 78.36,42.16 70.23,34.04 35.94,34.04 11.56,9.65 11.05,9.65 SW7.X2 10.92,9.53 10.92,6.86 8,3.94 2.67,3.94 SW7.CHOC2
N$15
  Top 0.127: U1.43 117.73,35.43 116.2,35.43 116.08,35.56 115.06,35.56 114.94,35.43 112.52,35.43 107.31,40.64 94.23,40.64 92.96,41.91 78.49,41.91 70.36,33.78 50.93,33.78 44.58,27.43 44.07,27.43 SW8.X2 43.94,27.3 43.94,24.64 41.02,21.72 35.69,21.72 SW8.CHOC2
N$16
  Top 0.127: U1.45 117.73,34.42 113.16,34.42 107.19,40.39 94.11,40.39 92.84,41.66 84.2,41.66 75.06,32.51 74.55,32.51 SW9.X2 74.42,32.38 74.42,29.72 71.5,26.8 66.17,26.8 SW9.CHOC2
N$17
  Top 0.127: U1.46 117.73,33.91 110.74,33.91 104.65,40.01 92.33,40.01 SW10.X2 92.2,40.01 92.2,37.34 89.28,34.42 83.95,34.42 SW10.CHOC2
N$18
  Top 0.127: U1.21 125.98,36.7 123.44,36.7 119.13,32.38 119,32.38 117.6,30.99 117.6,30.73 117.35,30.48 115.06,30.48 106.93,22.35 92.33,22.35 SW11.X2 92.2,22.23 92.2,19.56 89.28,16.64 83.95,16.64 SW11.CHOC2
N$19
  Top 0.152: J1.2 127.65,46.87 R1.1
N$20
  Top 0.152: J1.3 127,48.76 R2.1
N$21
  Top 0.127: U1.22 126.11,37.21 128.14,37.21 130.3,35.05 130.3,34.29 135.64,28.96 144.4,28.96 163.32,10.03 163.32,5.71 165.1,3.94 SW12.CHOC2 165.23,3.94 170.56,3.94 173.48,6.86 173.48,9.53 SW12.X2
N$22  (via drill 0.3)
  Top 0.127: v125.35,39.75 124.71,39.75 U1.25 | SW13.X2 140.46,27.3 140.46,24.64 137.54,21.72 132.21,21.72 SW13.CHOC2
  Bottom 0.127: v125.35,39.75 125.35,28.45 132.08,21.72 SW13.CHOC2
N$23  (via drill 0.3)
  Top 0.127: v120.78,37.97 123.06,37.97 124.08,38.99 124.08,39.62 U1.26 | SW14.CHOC2 101.73,26.8 107.06,26.8 109.98,29.72 109.98,32.38 SW14.X2
  Bottom 0.127: v120.78,37.97 117.47,37.97 112.01,32.51 110.11,32.51 SW14.X2
N$213
  Top 0.152: U1.5 121.17,29.73 120.15,28.71 R9.2 120.15,26.17 119.53,25.55 | C10.1 119.02,26.05 119.53,25.55 | 119.53,25.55 Q1.2
N$214
  Top 0.152: U1.6 121.67,28.46 R9.1 | R9.1 | R9.1 122.17,26.92 122.9,26.92 124.17,25.65 Q1.1 124.46,25.4 125.11,26.05 C11.1
RESET
  Top 0.127: R5.2 122.81,27.94 123.19,27.56 123.19,27.43 123.83,26.8 127.38,26.8 127.76,26.42 127.76,24.38 125.6,22.23 124.21,22.23 122.3,20.32 118.87,20.32 115.19,16.64 115.19,15.88 SW1.B
  Top 0.152: U1.7 122.17,29.58 C4.1 122.54,28.09 R5.2
SWCLK  (via drill 0.3)
  Top 0.127: v119.51,37.21 118.49,38.23 117.86,38.23 U1.37
  Top 0.152: J2.3 121.92,17.28 R6.2
  Bottom 0.127: v119.51,37.21 119.51,17.65 J2.3
SWDIO  (via drill 0.3)
  Top 0.127: v120.27,36.83 120.27,39.62 U1.34
  Top 0.152: J2.2 124.46,17.28 R7.2
  Bottom 0.127: v120.27,36.83 120.27,19.43 J2.2
VCC  (via drill 0.35)
  Top 0.152: 135.05,34.29 IC1.3 | R3.1 v120.13,43.68 v120.14,43.69
  Top 0.254: D1.C v129.54,46.23 C1.1 | C2.1 v133.6,34.29 135.05,34.29
  Route15 0.152: v133.6,34.29 133.6,42.16 v129.54,46.23 127,43.69 v120.14,43.69
VCC/2  (via drill 0.35)  (9 unrouted)
  Top 0.152: v136.4,36.83 135.31,36.83 IC1.2 135.25,36.83 | 132.84,37.02 C5.1 | C9.1 132.84,39.26 | U1.24 126.1,39.09 C8.1 127.65,39.99 v127.76,39.88 | U1.9 123.17,32.24 123.44,32.51 124.97,32.51 125.98,31.5 126.63,31.5 C7.1 127.65,31.13 v127.76,31.24 | U1.48 117.74,32.03 C6.1 116.19,31.13 v116.08,31.24 | R5.1 v124.21,27.94 | U1.36 117.09,39.74 C3.1 116.73,39.88 v116.08,39.88 | R7.1 v127,21.59 | R6.1 v124.46,21.59 | LED1.A v121.92,21.84
  Top 0.254: IC1.2 133.06,36.8 C5.1 | v132.84,38.35 132.84,38.1 | 132.84,38.1 132.84,37.02 | C9.1 132.84,39.26 132.84,38.1
  pour Route15: 0,0 177.8,0 177.8,68.58 0,68.58